# EAGLE schematic sensorBoard (EAGLE 9.5.0)
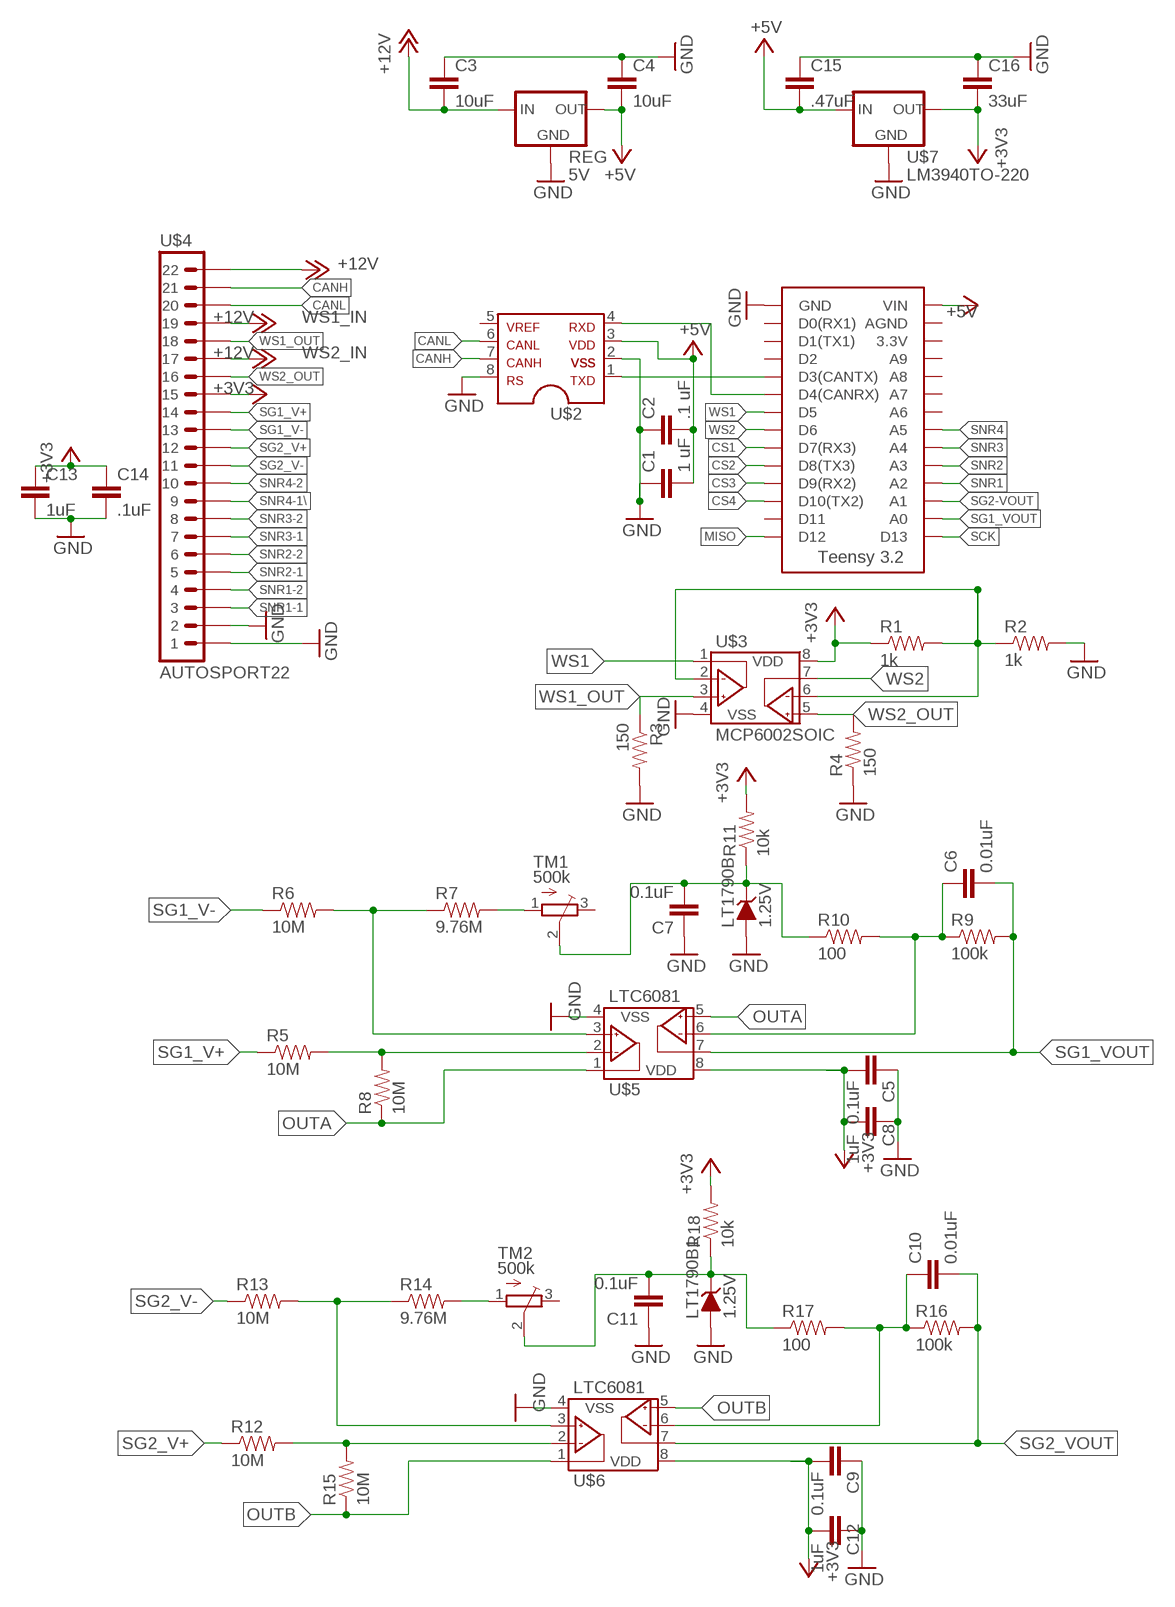
[diagram p0: schematic, sheet 1, part 1 of 2]
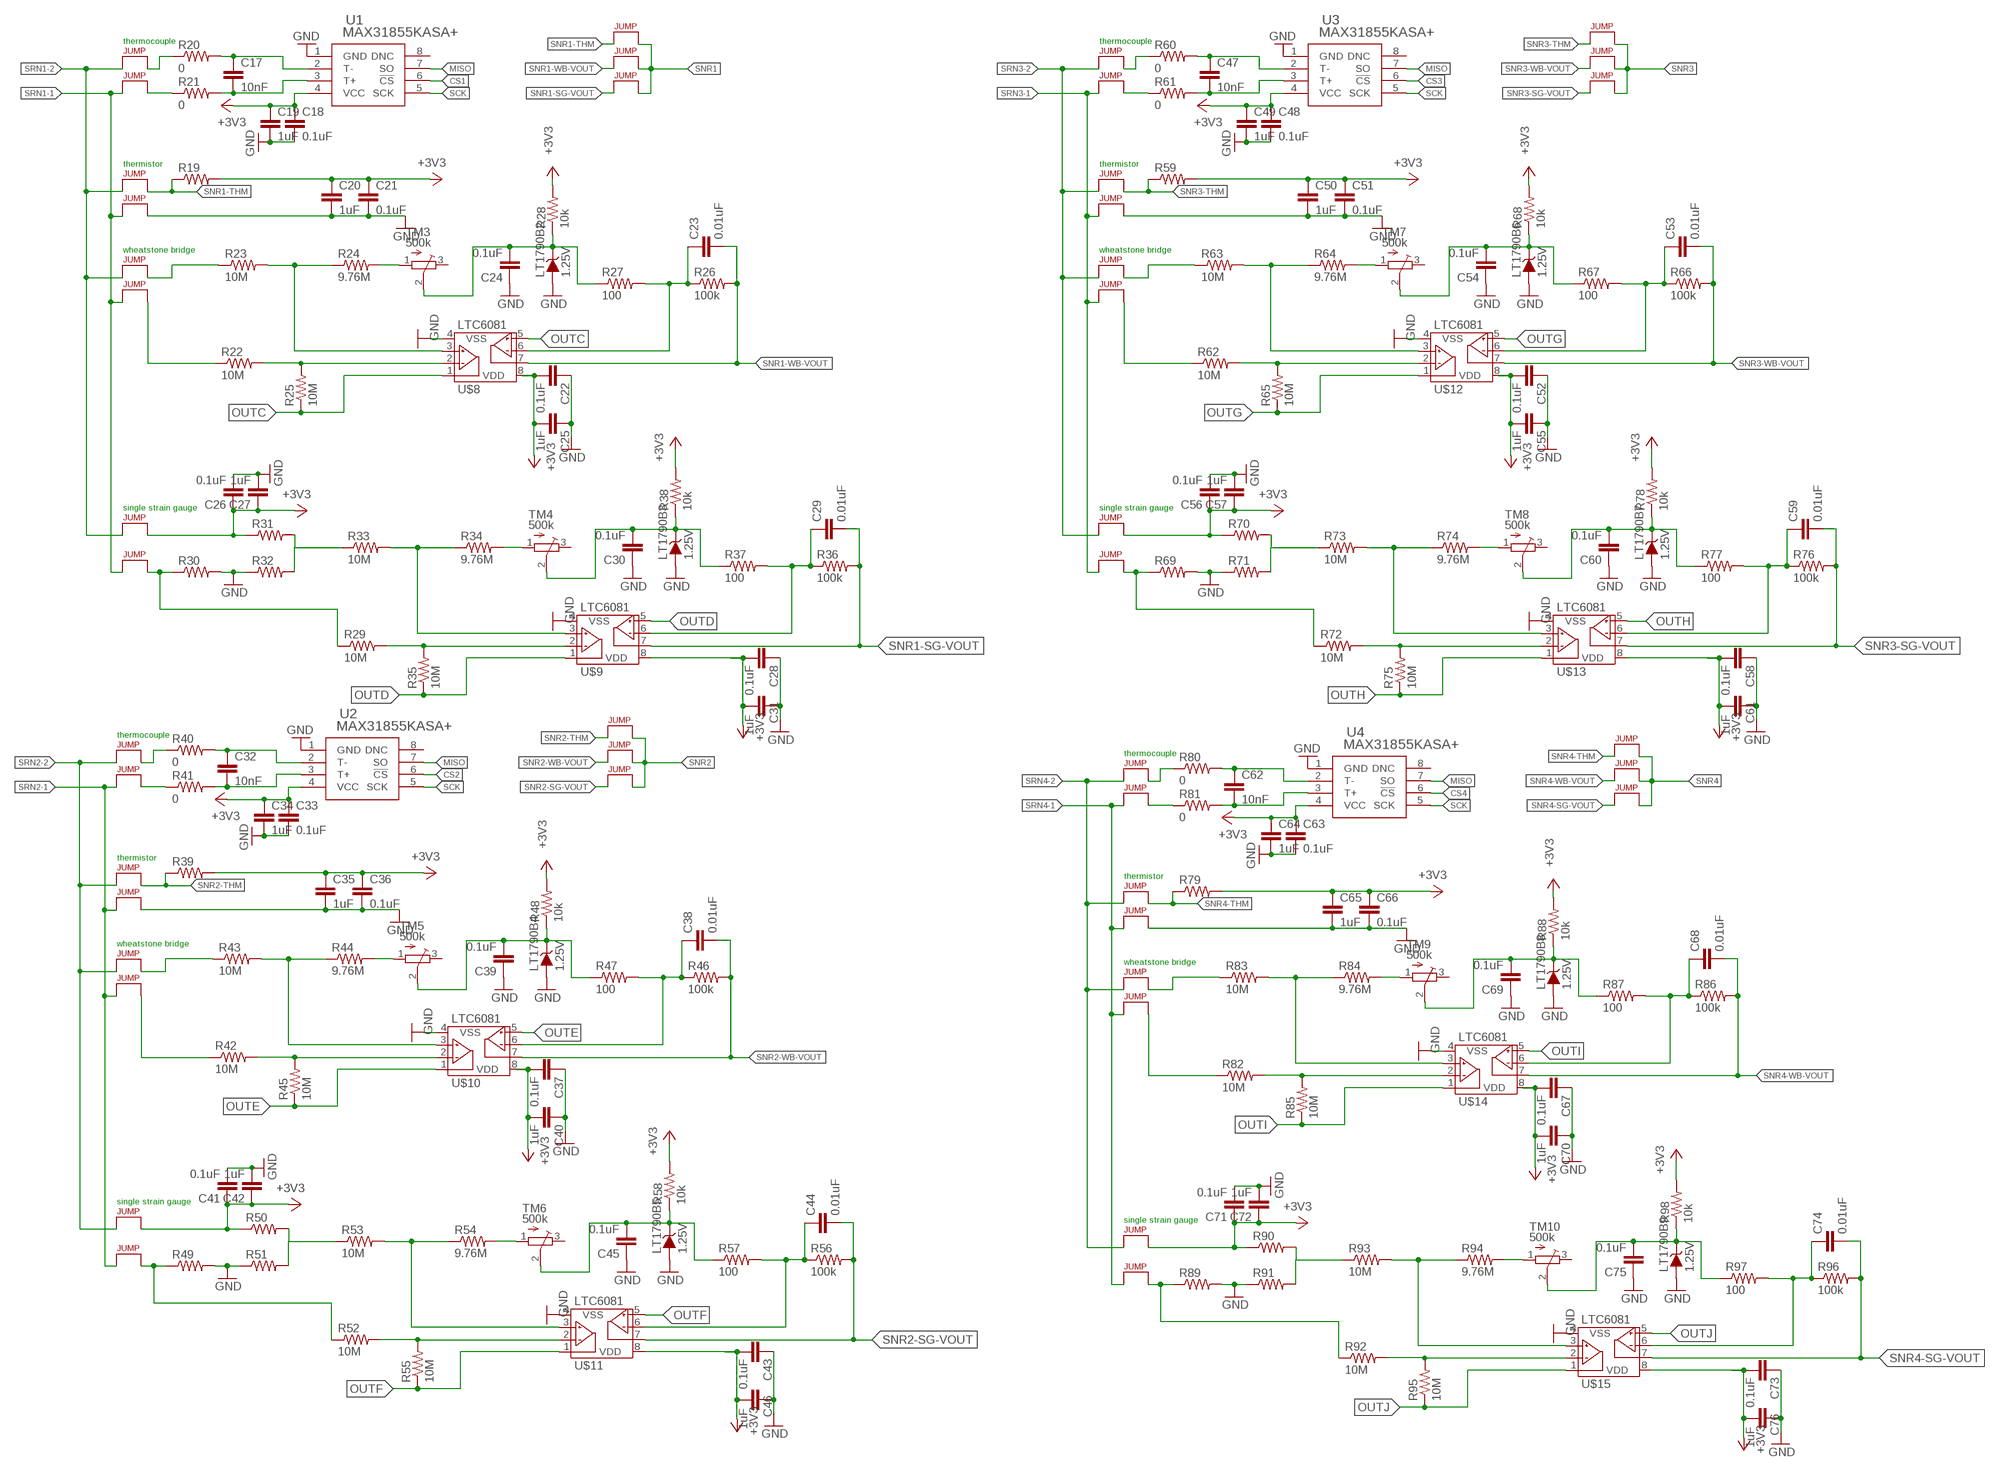
[diagram p1: schematic, sheet 1, part 2 of 2]

## Parts
C1  1 uF  CAP0603-CAP  [0603-CAP]
C2  .1 uF  CAP0603-CAP  [0603-CAP]
C3  10uF  CAP0603-CAP  [0603-CAP]
C4  10uF  CAP0603-CAP  [0603-CAP]
C5  0.1uF  CAP0603-CAP  [0603-CAP]
C6  0.01uF  CAP0603-CAP  [0603-CAP]
C7  0.1uF  CAP0603-CAP  [0603-CAP]
C8  1uF  CAP0603-CAP  [0603-CAP]
C9  0.1uF  CAP0603-CAP  [0603-CAP]
C10  0.01uF  CAP0603-CAP  [0603-CAP]
C11  0.1uF  CAP0603-CAP  [0603-CAP]
C12  1uF  CAP0603-CAP  [0603-CAP]
C13  1uF  CAP0603-CAP  [0603-CAP]
C14  .1uF  CAP0603-CAP  [0603-CAP]
C15  .47uF  CAP0603-CAP  [0603-CAP]
C16  33uF  CAP0603-CAP  [0603-CAP]
C17  10nF  CAP0603-CAP  [0603-CAP]
C18  0.1uF  CAP0603-CAP  [0603-CAP]
C19  1uF  CAP0603-CAP  [0603-CAP]
C20  1uF  CAP0603-CAP  [0603-CAP]
C21  0.1uF  CAP0603-CAP  [0603-CAP]
C22  0.1uF  CAP0805  [0805]
C23  0.01uF  CAP0805  [0805]
C24  0.1uF  CAP0805  [0805]
C25  1uF  CAP0805  [0805]
C26  0.1uF  CAP0603-CAP  [0603-CAP]
C27  1uF  CAP0603-CAP  [0603-CAP]
C28  0.1uF  CAP0805  [0805]
C29  0.01uF  CAP0805  [0805]
C30  0.1uF  CAP0805  [0805]
C31  1uF  CAP0805  [0805]
C32  10nF  CAP0603-CAP  [0603-CAP]
C33  0.1uF  CAP0603-CAP  [0603-CAP]
C34  1uF  CAP0603-CAP  [0603-CAP]
C35  1uF  CAP0603-CAP  [0603-CAP]
C36  0.1uF  CAP0603-CAP  [0603-CAP]
C37  0.1uF  CAP0805  [0805]
C38  0.01uF  CAP0805  [0805]
C39  0.1uF  CAP0805  [0805]
C40  1uF  CAP0805  [0805]
C41  0.1uF  CAP0603-CAP  [0603-CAP]
C42  1uF  CAP0603-CAP  [0603-CAP]
C43  0.1uF  CAP0805  [0805]
C44  0.01uF  CAP0805  [0805]
C45  0.1uF  CAP0805  [0805]
C46  1uF  CAP0805  [0805]
C47  10nF  CAP0603-CAP  [0603-CAP]
C48  0.1uF  CAP0603-CAP  [0603-CAP]
C49  1uF  CAP0603-CAP  [0603-CAP]
C50  1uF  CAP0603-CAP  [0603-CAP]
C51  0.1uF  CAP0603-CAP  [0603-CAP]
C52  0.1uF  CAP0805  [0805]
C53  0.01uF  CAP0805  [0805]
C54  0.1uF  CAP0805  [0805]
C55  1uF  CAP0805  [0805]
C56  0.1uF  CAP0603-CAP  [0603-CAP]
C57  1uF  CAP0603-CAP  [0603-CAP]
C58  0.1uF  CAP0805  [0805]
C59  0.01uF  CAP0805  [0805]
C60  0.1uF  CAP0805  [0805]
C61  1uF  CAP0805  [0805]
C62  10nF  CAP0603-CAP  [0603-CAP]
C63  0.1uF  CAP0603-CAP  [0603-CAP]
C64  1uF  CAP0603-CAP  [0603-CAP]
C65  1uF  CAP0603-CAP  [0603-CAP]
C66  0.1uF  CAP0603-CAP  [0603-CAP]
C67  0.1uF  CAP0805  [0805]
C68  0.01uF  CAP0805  [0805]
C69  0.1uF  CAP0805  [0805]
C70  1uF  CAP0805  [0805]
C71  0.1uF  CAP0603-CAP  [0603-CAP]
C72  1uF  CAP0603-CAP  [0603-CAP]
C73  0.1uF  CAP0805  [0805]
C74  0.01uF  CAP0805  [0805]
C75  0.1uF  CAP0805  [0805]
C76  1uF  CAP0805  [0805]
J1  JUMPER.1  [1X02]
J2  JUMPER.1  [1X02]
J3  JUMPER.1  [1X02]
J4  JUMPER.1  [1X02]
J5  JUMPER.1  [1X02]
J6  JUMPER.1  [1X02]
J7  JUMPER.1  [1X02]
J8  JUMPER.1  [1X02]
J9  JUMPER.1  [1X02]
J10  JUMPER.1  [1X02]
J11  JUMPER.1  [1X02]
J12  JUMPER.1  [1X02]
J13  JUMPER.1  [1X02]
J14  JUMPER.1  [1X02]
J15  JUMPER.1  [1X02]
J16  JUMPER.1  [1X02]
J17  JUMPER.1  [1X02]
J18  JUMPER.1  [1X02]
J19  JUMPER.1  [1X02]
J20  JUMPER.1  [1X02]
J21  JUMPER.1  [1X02]
J22  JUMPER.1  [1X02]
J23  JUMPER.1  [1X02]
J24  JUMPER.1  [1X02]
J25  JUMPER.1  [1X02]
J26  JUMPER.1  [1X02]
J27  JUMPER.1  [1X02]
J28  JUMPER.1  [1X02]
J29  JUMPER.1  [1X02]
J30  JUMPER.1  [1X02]
J31  JUMPER.1  [1X02]
J32  JUMPER.1  [1X02]
J33  JUMPER.1  [1X02]
J34  JUMPER.1  [1X02]
J35  JUMPER.1  [1X02]
J36  JUMPER.1  [1X02]
J37  JUMPER.1  [1X02]
J38  JUMPER.1  [1X02]
J39  JUMPER.1  [1X02]
J40  JUMPER.1  [1X02]
J41  JUMPER.1  [1X02]
J42  JUMPER.1  [1X02]
J43  JUMPER.1  [1X02]
J44  JUMPER.1  [1X02]
LT1790B  1.25V  DIODE_ZENER0805  [0805_D]
LT1790B1  1.25V  DIODE_ZENER0805  [0805_D]
LT1790B2  1.25V  DIODE_ZENER0805  [0805_D]
LT1790B3  1.25V  DIODE_ZENER0805  [0805_D]
LT1790B4  1.25V  DIODE_ZENER0805  [0805_D]
LT1790B5  1.25V  DIODE_ZENER0805  [0805_D]
LT1790B6  1.25V  DIODE_ZENER0805  [0805_D]
LT1790B7  1.25V  DIODE_ZENER0805  [0805_D]
LT1790B8  1.25V  DIODE_ZENER0805  [0805_D]
LT1790B9  1.25V  DIODE_ZENER0805  [0805_D]
R1  1k  RESISTOR0603-RES  [0603-RES]
R2  1k  RESISTOR0603-RES  [0603-RES]
R3  150  RESISTOR0603-RES  [0603-RES]
R4  150  RESISTOR0603-RES  [0603-RES]
R5  10M  RESISTOR0603-RES  [0603-RES]
R6  10M  RESISTOR0603-RES  [0603-RES]
R7  9.76M  RESISTOR0603-RES  [0603-RES]
R8  10M  RESISTOR0603-RES  [0603-RES]
R9  100k  RESISTOR0603-RES  [0603-RES]
R10  100  RESISTOR0603-RES  [0603-RES]
R11  10k  RESISTOR0603  [0603-RES]
R12  10M  RESISTOR0603-RES  [0603-RES]
R13  10M  RESISTOR0603-RES  [0603-RES]
R14  9.76M  RESISTOR0603-RES  [0603-RES]
R15  10M  RESISTOR0603-RES  [0603-RES]
R16  100k  RESISTOR0603-RES  [0603-RES]
R17  100  RESISTOR0603-RES  [0603-RES]
R18  10k  RESISTOR0603-RES  [0603-RES]
R19  RESISTOR0603-RES  [0603-RES]
R20  0  RESISTOR0603  [0603-RES]
R21  0  RESISTOR0603  [0603-RES]
R22  10M  RESISTOR0805-RES  [0805]
R23  10M  RESISTOR0805-RES  [0805]
R24  9.76M  RESISTOR0805-RES  [0805]
R25  10M  RESISTOR0805-RES  [0805]
R26  100k  RESISTOR0805-RES  [0805]
R27  100  RESISTOR0805-RES  [0805]
R28  10k  RESISTOR0805-RES  [0805]
R29  10M  RESISTOR0805-RES  [0805]
R30  RESISTOR0603  [0603-RES]
R31  RESISTOR0603  [0603-RES]
R32  RESISTOR0603  [0603-RES]
R33  10M  RESISTOR0805-RES  [0805]
R34  9.76M  RESISTOR0805-RES  [0805]
R35  10M  RESISTOR0805-RES  [0805]
R36  100k  RESISTOR0805-RES  [0805]
R37  100  RESISTOR0805-RES  [0805]
R38  10k  RESISTOR0805-RES  [0805]
R39  RESISTOR0603-RES  [0603-RES]
R40  0  RESISTOR0603  [0603-RES]
R41  0  RESISTOR0603  [0603-RES]
R42  10M  RESISTOR0805-RES  [0805]
R43  10M  RESISTOR0805-RES  [0805]
R44  9.76M  RESISTOR0805-RES  [0805]
R45  10M  RESISTOR0805-RES  [0805]
R46  100k  RESISTOR0805-RES  [0805]
R47  100  RESISTOR0805-RES  [0805]
R48  10k  RESISTOR0805-RES  [0805]
R49  RESISTOR0603  [0603-RES]
R50  RESISTOR0603  [0603-RES]
R51  RESISTOR0603  [0603-RES]
R52  10M  RESISTOR0805-RES  [0805]
R53  10M  RESISTOR0805-RES  [0805]
R54  9.76M  RESISTOR0805-RES  [0805]
R55  10M  RESISTOR0805-RES  [0805]
R56  100k  RESISTOR0805-RES  [0805]
R57  100  RESISTOR0805-RES  [0805]
R58  10k  RESISTOR0805-RES  [0805]
R59  RESISTOR0603-RES  [0603-RES]
R60  0  RESISTOR0603  [0603-RES]
R61  0  RESISTOR0603  [0603-RES]
R62  10M  RESISTOR0805-RES  [0805]
R63  10M  RESISTOR0805-RES  [0805]
R64  9.76M  RESISTOR0805-RES  [0805]
R65  10M  RESISTOR0805-RES  [0805]
R66  100k  RESISTOR0805-RES  [0805]
R67  100  RESISTOR0805-RES  [0805]
R68  10k  RESISTOR0805-RES  [0805]
R69  RESISTOR0603  [0603-RES]
R70  RESISTOR0603  [0603-RES]
R71  RESISTOR0603  [0603-RES]
R72  10M  RESISTOR0805-RES  [0805]
R73  10M  RESISTOR0805-RES  [0805]
R74  9.76M  RESISTOR0805-RES  [0805]
R75  10M  RESISTOR0805-RES  [0805]
R76  100k  RESISTOR0805-RES  [0805]
R77  100  RESISTOR0805-RES  [0805]
R78  10k  RESISTOR0805-RES  [0805]
R79  RESISTOR0603-RES  [0603-RES]
R80  0  RESISTOR0603  [0603-RES]
R81  0  RESISTOR0603  [0603-RES]
R82  10M  RESISTOR0805-RES  [0805]
R83  10M  RESISTOR0805-RES  [0805]
R84  9.76M  RESISTOR0805-RES  [0805]
R85  10M  RESISTOR0805-RES  [0805]
R86  100k  RESISTOR0805-RES  [0805]
R87  100  RESISTOR0805-RES  [0805]
R88  10k  RESISTOR0805-RES  [0805]
R89  RESISTOR0603  [0603-RES]
R90  RESISTOR0603  [0603-RES]
R91  RESISTOR0603  [0603-RES]
R92  10M  RESISTOR0805-RES  [0805]
R93  10M  RESISTOR0805-RES  [0805]
R94  9.76M  RESISTOR0805-RES  [0805]
R95  10M  RESISTOR0805-RES  [0805]
R96  100k  RESISTOR0805-RES  [0805]
R97  100  RESISTOR0805-RES  [0805]
R98  10k  RESISTOR0805-RES  [0805]
REG  5V  OKI-78SR-5  [OKI-78SR]
TM1  500k  TRIMPOTTC33X  [TC33X]
TM2  500k  TRIMPOTTC33X  [TC33X]
TM3  500k  TRIMPOTTC33X  [TC33X]
TM4  500k  TRIMPOTTC33X  [TC33X]
TM5  500k  TRIMPOTTC33X  [TC33X]
TM6  500k  TRIMPOTTC33X  [TC33X]
TM7  500k  TRIMPOTTC33X  [TC33X]
TM8  500k  TRIMPOTTC33X  [TC33X]
TM9  500k  TRIMPOTTC33X  [TC33X]
TM10  500k  TRIMPOTTC33X  [TC33X]
U1  MAX31855KASA+  [21-0041B_8]
U2  MAX31855KASA+  [21-0041B_8]
U3  MAX31855KASA+  [21-0041B_8]
U4  MAX31855KASA+  [21-0041B_8]
U$1  TEENSY_3.2_SIMPLE  [TEENSY_3.2_SIMPLE]
U$2  MCP2551  [SOIC-08]
U$3  MCP6002SOIC  [SOIC-08]
U$4  AUTOSPORT22  (no package)
U$5  LTC6081  [MSOP-8_MS]
U$6  LTC6081  [MSOP-8_MS]
U$7  LM3940TO-220  [TO-220]
U$8  LTC6081  [MSOP-8_MS]
U$9  LTC6081  [MSOP-8_MS]
U$10  LTC6081  [MSOP-8_MS]
U$11  LTC6081  [MSOP-8_MS]
U$12  LTC6081  [MSOP-8_MS]
U$13  LTC6081  [MSOP-8_MS]
U$14  LTC6081  [MSOP-8_MS]
U$15  LTC6081  [MSOP-8_MS]

## Nets
+3V3: C5.2 C8.1 C9.2 C12.1 C13.1 C14.1 C16.2 C18.1 C19.1 C20.1 C21.1 C22.2 C25.2 C28.2 C31.1 C33.1 C34.1 C35.1 C36.1 C37.2 C40.2 C43.2 C46.1 C48.1 C49.1 C50.1 C51.1 C52.2 C55.2 C58.2 C61.1 C63.1 C64.1 C65.1 C66.1 C67.2 C70.2 C73.2 C76.1 R1.1 R11.2 R18.2 R19.2 R28.2 R38.2 R39.2 R48.2 R58.2 R59.2 R68.2 R78.2 R79.2 R88.2 R98.2 U1.4(VCC) U2.4(VCC) U3.4(VCC) U4.4(VCC) U$3.8(VDD) U$4.15 U$5.8(VDD) U$6.8(VDD) U$7.3(OUT) U$8.8(VDD) U$9.8(VDD) U$10.8(VDD) U$11.8(VDD) U$12.8(VDD) U$13.8(VDD) U$14.8(VDD) U$15.8(VDD)
+5V: C1.2 C2.2 C4.2 C15.2 REG.3(OUT) U$1.VIN U$2.3 U$7.1(IN)
+12V: C3.2 REG.1(IN) U$4.22
CANH: U$2.7 U$4.21
CANL: U$2.6 U$4.20
CS1: U1.6(!CS) U$1.D7(RX3)
CS2: U2.6(!CS) U$1.D8(TX3)
CS3: U3.6(!CS) U$1.D9(RX2)
CS4: U4.6(!CS) U$1.D10(TX2)
GND: C1.1 C2.1 C3.1 C4.1 C5.1 C7.1 C8.2 C9.1 C11.1 C12.2 C13.2 C14.2 C15.1 C16.1 C18.2 C19.2 C20.2 C21.2 C22.1 C24.1 C25.1 C26.2 C27.2 C28.1 C30.1 C31.2 C33.2 C34.2 C35.2 C36.2 C37.1 C39.1 C40.1 C41.2 C42.2 C43.1 C45.1 C46.2 C48.2 C49.2 C50.2 C51.2 C52.1 C54.1 C55.1 C56.2 C57.2 C58.1 C60.1 C61.2 C63.2 C64.2 C65.2 C66.2 C67.1 C69.1 C70.1 C71.2 C72.2 C73.1 C75.1 C76.2 J4.2 J12.2 J20.2 J28.2 LT1790B1.A LT1790B2.A LT1790B3.A LT1790B4.A LT1790B5.A LT1790B6.A LT1790B7.A LT1790B8.A LT1790B9.A LT1790B.A R2.2 R3.2 R4.1 R30.2 R32.1 R49.2 R51.1 R69.2 R71.1 R89.2 R91.1 REG.2(GND) U1.1(GND) U2.1(GND) U3.1(GND) U4.1(GND) U$1.GND U$2.2 U$2.8 U$3.4(VSS) U$4.1 U$4.2 U$5.4(VSS) U$6.4(VSS) U$7.2(GND) U$8.4(VSS) U$9.4(VSS) U$10.4(VSS) U$11.4(VSS) U$12.4(VSS) U$13.4(VSS) U$14.4(VSS) U$15.4(VSS)
INB-: C6.1 R9.1 R10.2 U$5.6(VINB-)
INB-1: C10.1 R16.1 R17.2 U$6.6(VINB-)
INB-2: C23.1 R26.1 R27.2 U$8.6(VINB-)
INB-3: C29.1 R36.1 R37.2 U$9.6(VINB-)
INB-4: C38.1 R46.1 R47.2 U$10.6(VINB-)
INB-5: C44.1 R56.1 R57.2 U$11.6(VINB-)
INB-6: C53.1 R66.1 R67.2 U$12.6(VINB-)
INB-7: C59.1 R76.1 R77.2 U$13.6(VINB-)
INB-8: C68.1 R86.1 R87.2 U$14.6(VINB-)
INB-9: C74.1 R96.1 R97.2 U$15.6(VINB-)
MISO: U1.7(SO) U2.7(SO) U3.7(SO) U4.7(SO) U$1.D12
N$1: U$1.D4(CANRX) U$2.4
N$2: C17.1 R20.2 U1.2(T-)
N$3: U$1.D3(CANTX) U$2.1
N$4: R1.2 R2.1 U$3.2(VINA-) U$3.6(VINB-)
N$5: R5.2 R8.2 U$5.2(VINA-)
N$6: C17.2 R21.2 U1.3(T+)
N$7: J2.2 R21.1
N$8: R6.2 R7.1 U$5.3(VINA+)
N$9: C7.2 LT1790B.C R10.1 R11.1 TM1.2(S)
N$10: R7.2 TM1.1(A)
N$11: R12.2 R15.2 U$6.2(VINA-)
N$12: R13.2 R14.1 U$6.3(VINA+)
N$13: C11.2 LT1790B1.C R17.1 R18.1 TM2.2(S)
N$14: R14.2 TM2.1(A)
N$15: J1.2 R20.1
N$16: R22.2 R25.2 U$8.2(VINA-)
N$17: R23.2 R24.1 U$8.3(VINA+)
N$18: C24.2 LT1790B2.C R27.1 R28.1 TM3.2(S)
N$19: R24.2 TM3.1(A)
N$20: C26.1 C27.1 C41.1 C42.1 C56.1 C57.1 C71.1 C72.1 J7.2 J15.2 J23.2 J31.2 R31.1 R50.1 R70.1 R90.1 ; supply symbol labelled +3V3
N$21: J6.2 R22.1
N$22: R31.2 R32.2 R33.1
N$23: J8.2 R29.1 R30.1
N$24: C32.1 R40.2 U2.2(T-)
N$25: J5.2 R23.1
N$26: R29.2 R35.2 U$9.2(VINA-)
N$27: R33.2 R34.1 U$9.3(VINA+)
N$28: C30.2 LT1790B3.C R37.1 R38.1 TM4.2(S)
N$29: R34.2 TM4.1(A)
N$30: C32.2 R41.2 U2.3(T+)
N$31: J10.2 R41.1
N$32: J9.2 R40.1
N$33: R42.2 R45.2 U$10.2(VINA-)
N$34: R43.2 R44.1 U$10.3(VINA+)
N$35: C39.2 LT1790B4.C R47.1 R48.1 TM5.2(S)
N$36: R44.2 TM5.1(A)
N$37: R50.2 R51.2 R53.1
N$38: J16.2 R49.1 R52.1
N$39: J14.2 R42.1
N$40: J13.2 R43.1
N$41: R52.2 R55.2 U$11.2(VINA-)
N$42: R53.2 R54.1 U$11.3(VINA+)
N$43: C45.2 LT1790B5.C R57.1 R58.1 TM6.2(S)
N$44: R54.2 TM6.1(A)
N$45: C47.1 R60.2 U3.2(T-)
N$46: C47.2 R61.2 U3.3(T+)
N$47: J18.2 R61.1
N$48: J17.2 R60.1
N$49: R62.2 R65.2 U$12.2(VINA-)
N$50: R63.2 R64.1 U$12.3(VINA+)
N$51: C54.2 LT1790B6.C R67.1 R68.1 TM7.2(S)
N$52: R64.2 TM7.1(A)
N$53: R70.2 R71.2 R73.1
N$54: J24.2 R69.1 R72.1
N$55: J22.2 R62.1
N$56: J21.2 R63.1
N$57: R72.2 R75.2 U$13.2(VINA-)
N$58: R73.2 R74.1 U$13.3(VINA+)
N$59: C60.2 LT1790B7.C R77.1 R78.1 TM8.2(S)
N$60: R74.2 TM8.1(A)
N$61: C62.1 R80.2 U4.2(T-)
N$62: C62.2 R81.2 U4.3(T+)
N$63: J26.2 R81.1
N$64: J25.2 R80.1
N$65: R82.2 R85.2 U$14.2(VINA-)
N$66: R83.2 R84.1 U$14.3(VINA+)
N$67: C69.2 LT1790B8.C R87.1 R88.1 TM9.2(S)
N$68: R84.2 TM9.1(A)
N$69: R90.2 R91.2 R93.1
N$70: J32.2 R89.1 R92.1
N$71: J30.2 R82.1
N$72: J29.2 R83.1
N$73: R92.2 R95.2 U$15.2(VINA-)
N$74: R93.2 R94.1 U$15.3(VINA+)
N$75: C75.2 LT1790B9.C R97.1 R98.1 TM10.2(S)
N$76: R94.2 TM10.1(A)
OUTA: R8.1 U$5.1(VOUTA) U$5.5(VINB+)
OUTB: R15.1 U$6.1(VOUTA) U$6.5(VINB+)
OUTC: R25.1 U$8.1(VOUTA) U$8.5(VINB+)
OUTD: R35.1 U$9.1(VOUTA) U$9.5(VINB+)
OUTE: R45.1 U$10.1(VOUTA) U$10.5(VINB+)
OUTF: R55.1 U$11.1(VOUTA) U$11.5(VINB+)
OUTG: R65.1 U$12.1(VOUTA) U$12.5(VINB+)
OUTH: R75.1 U$13.1(VOUTA) U$13.5(VINB+)
OUTI: R85.1 U$14.1(VOUTA) U$14.5(VINB+)
OUTJ: R95.1 U$15.1(VOUTA) U$15.5(VINB+)
SCK: U1.5(SCK) U2.5(SCK) U3.5(SCK) U4.5(SCK) U$1.D13
SG1_V+: R5.1 U$4.14
SG1_V-: R6.1 U$4.13
SG1_VOUT: C6.2 R9.2 U$1.A0 U$5.7(VOUTB)
SG2-VOUT: U$1.A1
SG2_V+: R12.1 U$4.12
SG2_V-: R13.1 U$4.11
SG2_VOUT: C10.2 R16.2 U$6.7(VOUTB)
SNR1: J33.2 J34.2 J35.2 U$1.A2
SNR1-1: U$4.3
SNR1-2: U$4.4
SNR1-SG-VOUT: C29.2 J35.1 R36.2 U$9.7(VOUTB)
SNR1-THM: J3.2 J33.1 R19.1
SNR1-WB-VOUT: C23.2 J34.1 R26.2 U$8.7(VOUTB)
SNR2: J42.2 J43.2 J44.2 U$1.A3
SNR2-1: U$4.5
SNR2-2: U$4.6
SNR2-SG-VOUT: C44.2 J42.1 R56.2 U$11.7(VOUTB)
SNR2-THM: J11.2 J44.1 R39.1
SNR2-WB-VOUT: C38.2 J43.1 R46.2 U$10.7(VOUTB)
SNR3: J36.2 J37.2 J38.2 U$1.A4
SNR3-1: U$4.7
SNR3-2: U$4.8
SNR3-SG-VOUT: C59.2 J38.1 R76.2 U$13.7(VOUTB)
SNR3-THM: J19.2 J36.1 R59.1
SNR3-WB-VOUT: C53.2 J37.1 R66.2 U$12.7(VOUTB)
SNR4: J39.2 J40.2 J41.2 U$1.A5
SNR4-1\: U$4.9
SNR4-2: U$4.10
SNR4-SG-VOUT: C74.2 J41.1 R96.2 U$15.7(VOUTB)
SNR4-THM: J27.2 J39.1 R79.1
SNR4-WB-VOUT: C68.2 J40.1 R86.2 U$14.7(VOUTB)
SRN1-1: J2.1 J4.1 J6.1 J8.1
SRN1-2: J1.1 J3.1 J5.1 J7.1
SRN2-1: J10.1 J12.1 J14.1 J16.1
SRN2-2: J9.1 J11.1 J13.1 J15.1
SRN3-1: J18.1 J20.1 J22.1 J24.1
SRN3-2: J17.1 J19.1 J21.1 J23.1
SRN4-1: J26.1 J28.1 J30.1 J32.1
SRN4-2: J25.1 J27.1 J29.1 J31.1
WS1: U$1.D5 U$3.1(VOUTA)
WS1_IN: U$4.19 ; supply symbol labelled +12V
WS1_OUT: R3.1 U$3.3(VINA+) U$4.18
WS2: U$1.D6 U$3.7(VOUTB)
WS2_IN: U$4.17 ; supply symbol labelled +12V
WS2_OUT: R4.2 U$3.5(VINB+) U$4.16
Unconnected: TM1.3(E) TM2.3(E) TM3.3(E) TM4.3(E) TM5.3(E) TM6.3(E) TM7.3(E) TM8.3(E) TM9.3(E) TM10.3(E) U1.8(DNC) U2.8(DNC) U3.8(DNC) U4.8(DNC) U$1.3.3V U$1.A6 U$1.A7 U$1.A8 U$1.A9 U$1.AGND U$1.D0(RX1) U$1.D1(TX1) U$1.D2 U$1.D11 U$2.5

## Notes on the sheet
- thermocouple | thermocouple
- thermistor | thermistor
- wheatstone bridge | wheatstone bridge
- single strain gauge | single strain gauge
- thermocouple
- thermocouple
- thermistor
- thermistor
- wheatstone bridge
- wheatstone bridge
- single strain gauge
- single strain gauge

## Library data of the parts
C1-C76 = HyTechDevices:CAP: Capacitor Standard 0603 ceramic capacitor, and 0.1" leaded capacitor.
J1-J44 = HyTechDevices:JUMPER: Jumper for changing operation of a device
LT1790B LT1790B1-LT1790B9 = HyTechDevices:DIODE_ZENER: ZENER DIODE
R1-R98 = HyTechDevices:RESISTOR: Resistor Basic schematic elements and footprints for 0603, 1206, and PTH resistors.
REG = HyTechDevices:OKI-78SR-5: Murata OKI-78SR 5V 1.5A Non-Isolated Switching Regulator DC/DC - Datasheet <https://power.murata.com/data/power/oki-78sr.pdf>
TM1-TM10 = HyTechDevices:TRIMPOT: SMT trimmer potentiometer part number TC33X http://www.ladyada.net/library/eagle
U1-U4 = HyTechDevices:MAX31855KASA+; MANUFACTURER_PART_NUMBER: MAX31855KASA+; VENDOR: Maxim Integrated Products
U$1 = HyTechDevices:TEENSY_3.2_SIMPLE: Simple version of the Teensy 3.2 board that only uses the 2 main rows of pins, not the inner pins or the pins opposite the usb port.
U$2 = HyTechDevices:MCP2551: MCP2551 High-Speed CAN Transceiver Product Webpage <https://www.microchip.com/wwwproducts/en/MCP2551> Datasheet <http://ww1.microchip.com/downloads/en/DeviceDoc/21667f.pdf> This device is outdated It is replaced by MCP2561. Comparison Page <https://www.microchip.com/wwwproducts/ProductCompare/MCP2551/MCP2561> Product Webpage <https://www.microchip.com/wwwproducts/en/MCP2561> Datasheet <http://ww1.microchip.com/downloads/en/DeviceDoc/20005167C.pdf>
U$3 = HyTechDevices:MCP6002: Microchip MCP6002 Dual Channel Op Amp
U$4 = HyTechSymbols:AUTOSPORT22
U$5 U$6 U$8-U$15 = HyTechDevices:LTC6081
U$7 = HyTechDevices:LM3940: Texas Instruments LM3940 3.3V Linear Regulator Datasheet <http://www.ti.com/lit/ds/symlink/lm3940.pdf> Use with 0.47µF input capacitor and 33µF output capacitor.